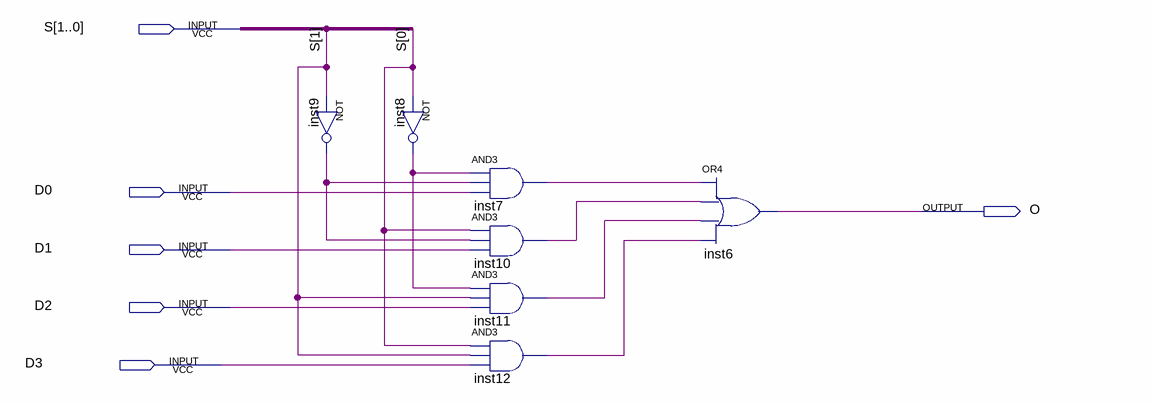
[diagram p0: schematic sheet]
// Quartus schematic MUX4to1.bdf as structural Verilog: 7 symbols, 6 pins
module MUX4to1 (
  input  [1:0] S,
  input  D0,
  input  D1,
  input  D2,
  input  D3,
  output O
);

  wire inst7_out, inst8_out, inst9_out, inst10_out, inst11_out, inst12_out;

  not inst9 (inst9_out, S[1]);
  not inst8 (inst8_out, S[0]);
  and inst7 (inst7_out, inst8_out, inst9_out, D0);
  and inst10 (inst10_out, S[0], inst9_out, D1);
  and inst11 (inst11_out, inst8_out, S[1], D2);
  and inst12 (inst12_out, S[0], S[1], D3);
  or inst6 (O, inst7_out, inst10_out, inst11_out, inst12_out);
endmodule
